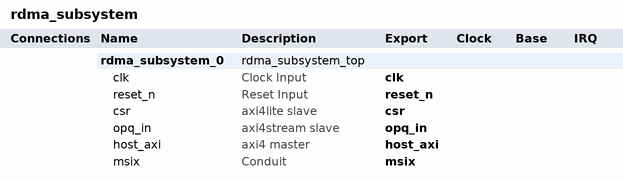
[diagram p0: system contents]
# Platform Designer (Qsys) system rdma_subsystem, Arria 10 10AX115N2F45E1SG
# Parameters at their usual value, and those the tool derives, are not listed.
package require qsys
create_system rdma_subsystem
set_project_property DEVICE_FAMILY {Arria 10}
set_project_property DEVICE 10AX115N2F45E1SG

add_instance rdma_subsystem_0 rdma_subsystem_top 26.1.0.0510
set_instance_parameter_value rdma_subsystem_0 DMA_DATA_W 256
set_instance_parameter_value rdma_subsystem_0 WQE_BUS_W 512
set_instance_parameter_value rdma_subsystem_0 DEBUG_LEVEL 0
set_instance_parameter_value rdma_subsystem_0 IP_UID 0x44514f50
set_instance_parameter_value rdma_subsystem_0 VERSION_MAJOR 26
set_instance_parameter_value rdma_subsystem_0 VERSION_MINOR 1
set_instance_parameter_value rdma_subsystem_0 VERSION_PATCH 0
set_instance_parameter_value rdma_subsystem_0 BUILD 510
set_instance_parameter_value rdma_subsystem_0 VERSION_DATE 20260510
set_instance_parameter_value rdma_subsystem_0 VERSION_GIT 0x0b66a91b
set_instance_parameter_value rdma_subsystem_0 INSTANCE_ID 0

# exported interfaces
add_interface clk clock sink
set_interface_property clk EXPORT_OF rdma_subsystem_0.clk
add_interface reset_n reset sink
set_interface_property reset_n EXPORT_OF rdma_subsystem_0.reset_n
add_interface csr axi4lite slave
set_interface_property csr EXPORT_OF rdma_subsystem_0.csr
add_interface opq_in axi4stream end
set_interface_property opq_in EXPORT_OF rdma_subsystem_0.opq_in
add_interface host_axi axi4 master
set_interface_property host_axi EXPORT_OF rdma_subsystem_0.host_axi
add_interface msix conduit start
set_interface_property msix EXPORT_OF rdma_subsystem_0.msix

save_system rdma_subsystem.qsys
